# Altium project RC-XD(RX).PrjPcb
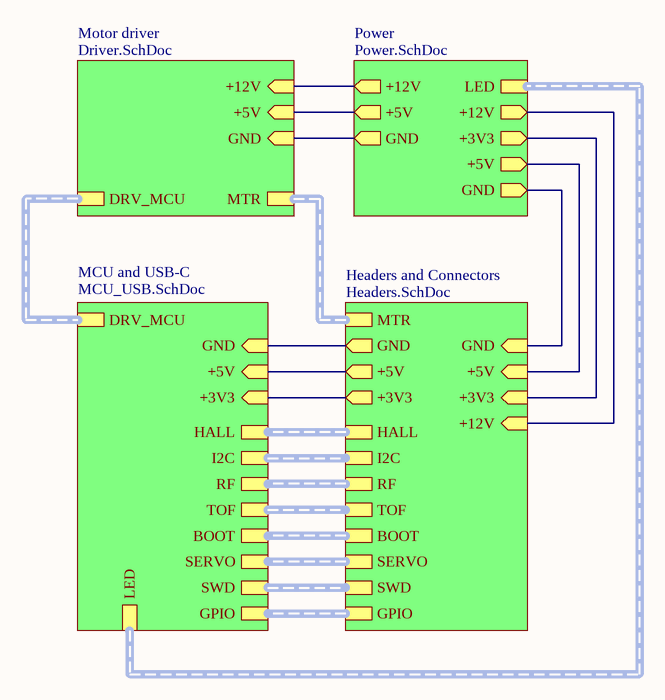
[diagram p0: Overview.SchDoc]
GlobalRevisionEngineer: Robin Madar; GlobalRevisionDate: 2026-03-08; GlobalProjectTitleAbr: RX_PCB; GlobalProjectTitle: RC-XD; GlobalProjectRevision: v1; GlobalAddress2: Harju maakond; GlobalAddress: Tallinn
5 sheets, 85 parts. Net scope: hierarchical (ports join the sheet entries above them; power ports are global).
Board file: RX.PcbDoc
Sheets:
  Overview.SchDoc
    Motor driver = Driver.SchDoc
    Power = Power.SchDoc
    MCU and USB-C = MCU_USB.SchDoc
    Headers and Connectors = Headers.SchDoc

## Sheet Overview.SchDoc
size 297 x 209 mm; SheetNumber: 1; SheetTotal: 5

### Sub-sheets
Headers and Connectors = Headers.SchDoc: +3V3 (in), GND (in), +5V (in), MTR, +3V3 (out), +5V (out), GND (out), HALL, I2C, RF, TOF, BOOT, +12V (in), SERVO, SWD, GPIO
MCU and USB-C = MCU_USB.SchDoc: +3V3 (in), GND (in), +5V (in), DRV_MCU, HALL, I2C, RF, TOF, BOOT, LED, SERVO, SWD, GPIO
Motor driver = Driver.SchDoc: +12V (in), +5V (in), GND (in), MTR, DRV_MCU
Power = Power.SchDoc: +12V (out), +3V3 (out), GND (out), GND (out), +5V (out), +5V (out), LED, +12V (out)

### Nets
(unnamed): sheet Motor driver/+12V, sheet Power/+12V, sheet Power/+12V, sheet Headers and Connectors/+12V
(unnamed): sheet Motor driver/+5V, sheet Power/+5V, sheet Power/+5V, sheet MCU and USB-C/+5V, sheet Headers and Connectors/+5V, sheet Headers and Connectors/+5V
(unnamed): sheet Motor driver/GND, sheet Power/GND, sheet Power/GND, sheet MCU and USB-C/GND, sheet Headers and Connectors/GND, sheet Headers and Connectors/GND
(unnamed): sheet Power/+3V3, sheet MCU and USB-C/+3V3, sheet Headers and Connectors/+3V3, sheet Headers and Connectors/+3V3

### Buses and harness runs
harness sheet Headers and Connectors/BOOT = sheet MCU and USB-C/BOOT
harness sheet Headers and Connectors/GPIO = sheet MCU and USB-C/GPIO
harness sheet Headers and Connectors/HALL = sheet MCU and USB-C/HALL
harness sheet Headers and Connectors/I2C = sheet MCU and USB-C/I2C
harness sheet Headers and Connectors/MTR = sheet Motor driver/MTR
harness sheet Headers and Connectors/RF = sheet MCU and USB-C/RF
harness sheet Headers and Connectors/SERVO = sheet MCU and USB-C/SERVO
harness sheet Headers and Connectors/SWD = sheet MCU and USB-C/SWD
harness sheet Headers and Connectors/TOF = sheet MCU and USB-C/TOF
harness sheet MCU and USB-C/DRV_MCU = sheet Motor driver/DRV_MCU
harness sheet MCU and USB-C/LED = sheet Power/LED

### Notes on the sheet
- THIS DOCUMENT AND THE DATA DISCLOSED HEREIN OR
- HEREWITH IS THE PROPERTY OF ALTIUM LIMITED AND MAY
- DWG NO:
- REVISION
- REV:
- DESCRIPTION
- DATE
- APPROVED
- BE FREELY DISTRIBUTED IN WHOLE. NO RIGHTS ARE
- RESERVED OR EXPRESS OR IMPLIED WARANTEE GIVEN.
- ENG:
- APPROVALS
- PROJECT
- DSN:
- CHK:
- REFERENCE DOCUMENTS
- PROJECT REVISION:
- TITLE
- DOCUMENT REVISION:
- DESIGN ITEM:
- BOM:
- FAB DWG:
- PCB DWG:
- ASSY DWG:
- SCALE:
- A3
- SIZE
- CAGE CODE
- FILE NAME
- DWG NO.
- SHEET
- OF
- REV

## Sheet Driver.SchDoc
size 297 x 209 mm; ENG_APP_DATE: --/--/--; DSN_APP_DATE: --/--/--; CHK_APP_DATE: --/--/--; SheetNumber: 2; SheetTotal: 5
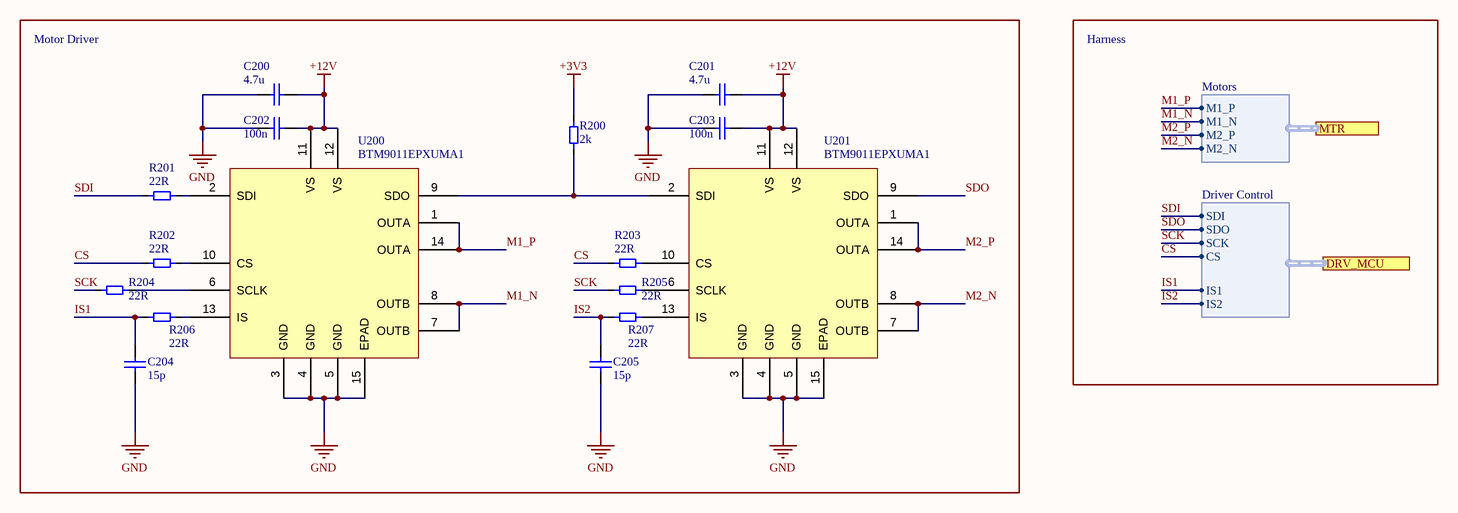
[diagram p1: Driver.SchDoc]

### Parts
C200  4.7u  [MLCC_0603_M]
C201  4.7u  [MLCC_0603_M]
C202  100n  [MLCC_0603_M]
C203  100n  [MLCC_0603_M]
C204  15p  [MLCC_0603_M]
C205  15p  [MLCC_0603_M]
R200  2k  [Resistor_0603_M]
R201  22R  [Resistor_0603_M]
R202  22R  [Resistor_0603_M]
R203  22R  [Resistor_0603_M]
R204  22R  [Resistor_0603_M]
R205  22R  [Resistor_0603_M]
R206  22R  [Resistor_0603_M]
R207  22R  [Resistor_0603_M]
U200  BTM9011EPXUMA1  [BTM9011EPXUMA1]
U201  BTM9011EPXUMA1  [BTM9011EPXUMA1]

### Blocks framed on the sheet
Motor Driver: C200-C205 R200-R207 U200 U201

### Ports
DRV_MCU (harness Driver Control, see Overview[3B], MCU_USB[2A]), MTR (harness Motors, see Overview[3B], Headers[2A])

### Harnesses
Motors: M1_P, M1_N, M2_P, M2_N
Driver Control: SCK, SDO, IS1, SDI, IS2, CS

### Nets
+3V3: R200.2
+12V: C200.2 C201.2 C202.2 C203.2 U200.11(VS) U200.12(VS) U201.11(VS) U201.12(VS)
GND: C200.1 C201.1 C202.1 C203.1 C204.2 C205.2 U200.3(GND) U200.4(GND) U200.5(GND) U200.15(EPAD) U201.3(GND) U201.4(GND) U201.5(GND) U201.15(EPAD)
CS: R202.1 R203.1 ; port DRV_MCU.CS
IS1: C204.1 R206.1 ; port DRV_MCU.IS1
IS2: C205.1 R207.1 ; port DRV_MCU.IS2
M1_N: U200.7(OUTB) U200.8(OUTB) ; port MTR.M1_N
M1_P: U200.1(OUTA) U200.14(OUTA) ; port MTR.M1_P
M2_N: U201.7(OUTB) U201.8(OUTB) ; port MTR.M2_N
M2_P: U201.1(OUTA) U201.14(OUTA) ; port MTR.M2_P
SCK: R204.1 R205.1 ; port DRV_MCU.SCK
SDI: R201.1 ; port DRV_MCU.SDI
SDO: U201.9(SDO) ; port DRV_MCU.SDO
NetR200_1: R200.1 U200.9(SDO) U201.2(SDI)
NetR201_2: R201.2 U200.2(SDI)
NetR202_2: R202.2 U200.10(CS)
NetR203_2: R203.2 U201.10(CS)
NetR204_2: R204.2 U200.6(SCLK)
NetR205_2: R205.2 U201.6(SCLK)
NetR206_2: R206.2 U200.13(IS)
NetR207_2: R207.2 U201.13(IS)

### Notes on the sheet
- Harness
- THIS DOCUMENT AND THE DATA DISCLOSED HEREIN OR
- HEREWITH IS THE PROPERTY OF ALTIUM LIMITED AND MAY
- DWG NO:
- REVISION
- REV:
- DESCRIPTION
- DATE
- APPROVED
- BE FREELY DISTRIBUTED IN WHOLE. NO RIGHTS ARE
- RESERVED OR EXPRESS OR IMPLIED WARANTEE GIVEN.
- ENG:
- APPROVALS
- PROJECT
- DSN:
- CHK:
- REFERENCE DOCUMENTS
- PROJECT REVISION:
- TITLE
- DOCUMENT REVISION:
- DESIGN ITEM:
- BOM:
- FAB DWG:
- PCB DWG:
- ASSY DWG:
- SCALE:
- A3
- SIZE
- CAGE CODE
- FILE NAME
- DWG NO.
- SHEET
- OF
- REV

### Library data of the parts
C200 C201 = CMP-001-1257-1: MLCC, 0603, 4.7u, 10%, 35V, X5R; Manufacturer: Any; Value: 4,7µF; Capacitor Type: Ceramic; Dielectric: X5R; Tolerance: 10%; Voltage: 35V; Part number: MLCC, 0603, 4.7u, 10%, 35V, X5R; Case/Package: 0603; Mount: SMD; RoHS: Yes
C202 C203 = CMP-001-0755-1: MLCC, 0603, 100n, 10%, 35V, X7R; Manufacturer: Any; Capacitor Type: Ceramic; Value: 100nF; Voltage: 35V; Case/Package: 0603; Part number: MLCC, 0603, 100n, 10%, 35V, X7R; RoHS: Yes; Tolerance: 10%; Dielectric: X7R; Mount: SMD
C204 C205 = CMP-001-0474-1: MLCC, 0603, 15p, 5%, 50V, C0G/NP0; Manufacturer: Any; Value: 15pF; Capacitor Type: Ceramic; Dielectric: C0G/NP0; Case/Package: 0603; Part number: MLCC, 0603, 15p, 5%, 50V, C0G/NP0; Voltage: 50V; Mount: SMD; RoHS: Yes; Tolerance: 5%
R200 = CMP-001-0084-2: Resistor, 0603, 2k, 1%, 1/10W; Manufacturer: Any; Power: 100mW; Mount: SMD; Value: 2k; RoHS: Yes; Case/Package: 0603; Part number: Resistor, 0603, 2k, 1%, 1/10W; Tolerance: 1%
R201-R207 = CMP-001-0038-3: Resistor, 0603, 22R, 1%, 1/10W; Manufacturer: Any; Value: 22; Power: 100mW; Part number: Resistor, 0603, 22R, 1%, 1/10W; Tolerance: 1%; Case/Package: 0603; Mount: SMD; RoHS: Yes
U200 U201 = CMP-00022-3: DC Mtr Drive, Brush, 150DEGC, TSSOPEP-14 Rohs Compliant: Yes; Manufacturer: Infineon Technologies; Current - Output: 9.2A; Voltage - Supply: 4.5V ~ 40V; Interface: SPI; Output configuration: Full bridge; Motor Type - AC, DC: Brushed DC; REACH SVHC: Yes; RoHS: Compliant; Voltage - Load: 4.5V ~ 40V; Operating Temperature: -40C ~ 150C; Case/Package: 14-TSSOP; Mount: SMD; Part number: BTM9011EPXUMA1

## Sheet Power.SchDoc
size 297 x 209 mm; SheetNumber: 3; SheetTotal: 5
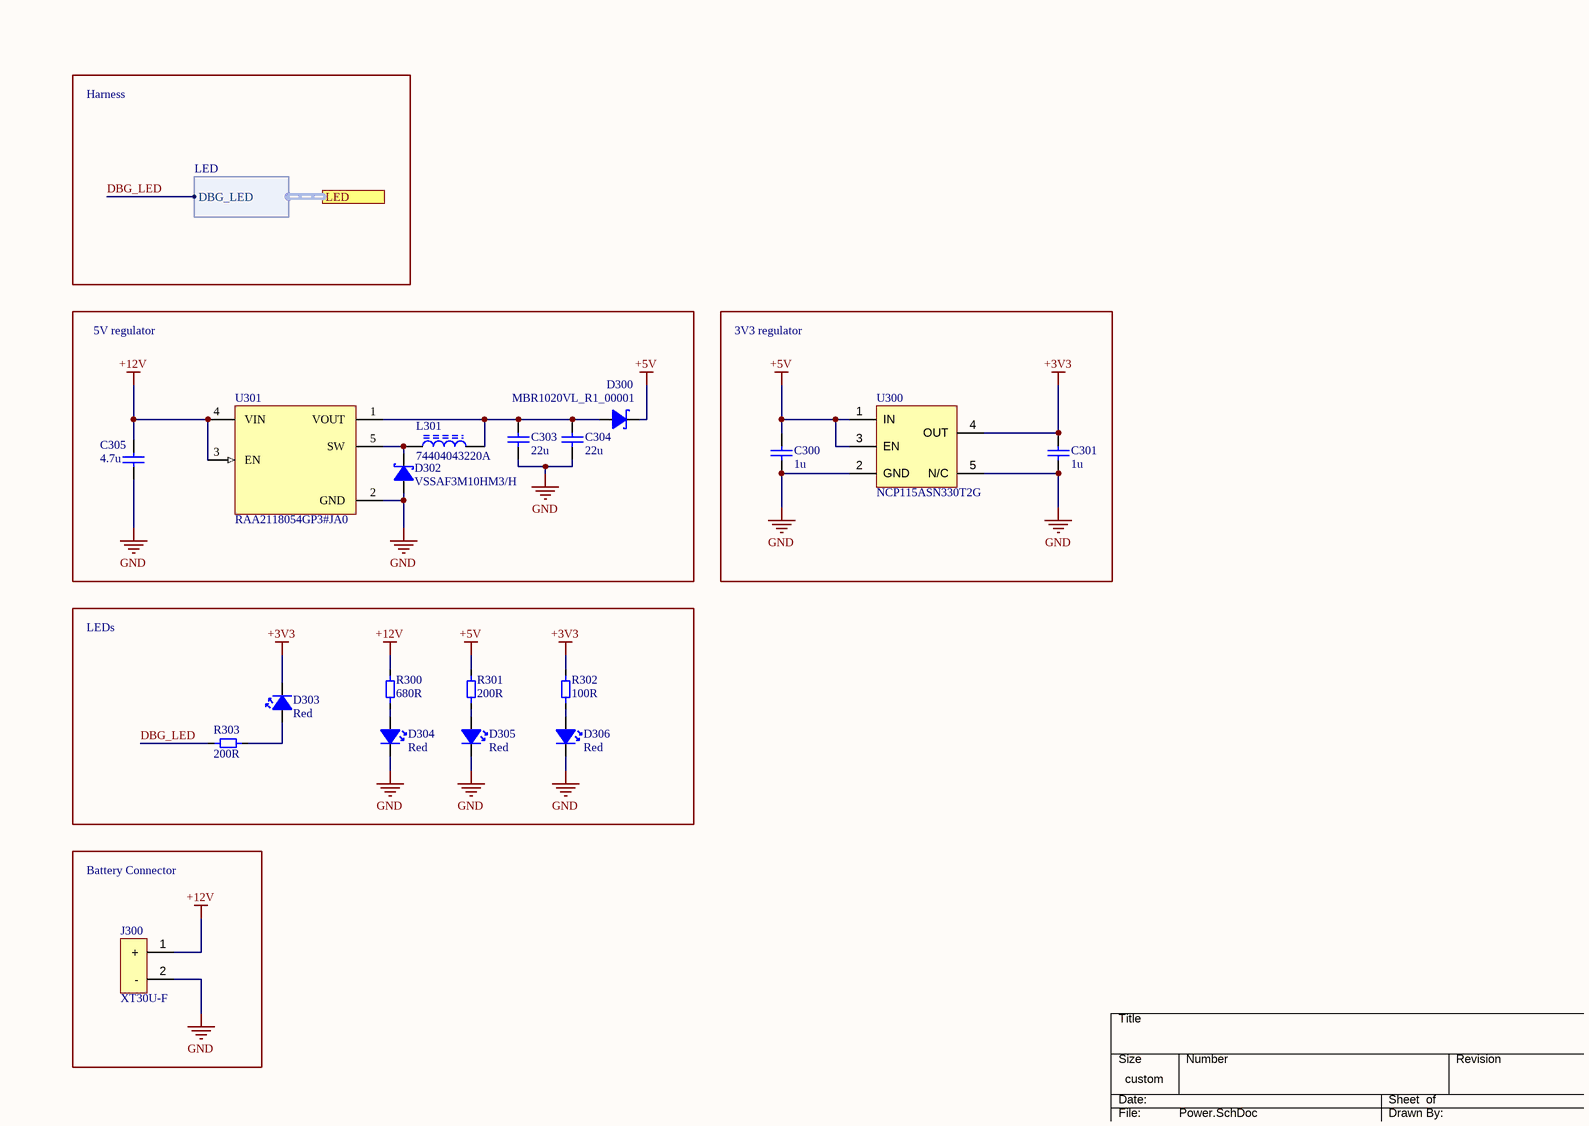
[diagram p2: Power.SchDoc]

### Parts
C300  1u  [MLCC_0603_M]
C301  1u  [MLCC_0603_M]
C303  22u  [MLCC_0603_M]
C304  22u  [MLCC_0603_M]
C305  4.7u  [MLCC_1206_M]
D300  MBR1020VL_R1_00001  [FP-MBR1020VL_R1_00001-MFG]
D302  VSSAF3M10HM3/H  [VSSAF3M10HM3_H-Footprint-1]
D303  Red  [0603 RED LED]
D304  Red  [0603 RED LED]
D305  Red  [0603 RED LED]
D306  Red  [0603 RED LED]
J300  XT30U-F  [XT30U-F]
L301  74404043220A  [WE-LQS_4025]
R300  680R  [Resistor_0603_M]
R301  200R  [Resistor_0603_M]
R302  100R  [Resistor_0603_M]
R303  200R  [Resistor_0603_M]
U300  NCP115ASN330T2G  [TSOP-5]
U301  RAA2118054GP3#JA0  [P5_064B_MFG]

### Blocks framed on the sheet
5V regulator: C303-C305 D300 D302 L301 U301
3V3 regulator: C300 C301 U300
LEDs: D303-D306 R300-R303
Battery Connector: J300

### Ports
LED (harness LED, see Overview[4B], MCU_USB[2B])

### Harnesses
LED: DBG_LED

### Nets
+3V3: C301.2 D303.1(C) R302.2 U300.4(OUT)
+5V: C300.2 D300.1(C) R301.1 U300.1(IN) U300.3(EN)
+12V: C305.2 J300.1(+) R300.2 U301.3(EN) U301.4(VIN)
GND: C300.1 C301.1 C303.1 C304.1 C305.1 D302.2(A) D304.1(C) D305.1(C) D306.1(C) J300.2(-) U300.2(GND) U300.5(N/C) U301.2(GND)
DBG_LED: R303.1 ; port LED.DBG_LED
NetC303_2: C303.2 C304.2 D300.2(A) L301.2 U301.1(VOUT)
NetD302_1: D302.1(C) L301.1 U301.5(SW)
NetD303_2: D303.2(A) R303.2
NetD304_2: D304.2(A) R300.1
NetD305_2: D305.2(A) R301.2
NetD306_2: D306.2(A) R302.1

### Notes on the sheet
- Harness
- THIS DOCUMENT AND THE DATA DISCLOSED HEREIN OR
- HEREWITH IS THE PROPERTY OF ALTIUM LIMITED AND MAY
- DWG NO:
- REVISION
- REV:
- DESCRIPTION
- DATE
- APPROVED
- BE FREELY DISTRIBUTED IN WHOLE. NO RIGHTS ARE
- RESERVED OR EXPRESS OR IMPLIED WARANTEE GIVEN.
- ENG:
- APPROVALS
- PROJECT
- DSN:
- CHK:
- REFERENCE DOCUMENTS
- PROJECT REVISION:
- TITLE
- DOCUMENT REVISION:
- DESIGN ITEM:
- BOM:
- FAB DWG:
- PCB DWG:
- ASSY DWG:
- SCALE:
- A3
- SIZE
- CAGE CODE
- FILE NAME
- DWG NO.
- SHEET
- OF
- REV

### Library data of the parts
C300 C301 = CMP-001-0565-1: MLCC, 0603, 1u, 10%, 50V, X5R; Manufacturer: Any; Capacitor Type: Ceramic; Value: 1µF; Part number: MLCC, 0603, 1u, 10%, 50V, X5R; Dielectric: X5R; Voltage: 50V; RoHS: Yes; Tolerance: 10%; Mount: SMD; Case/Package: 0603
C303 C304 = CMP-001-1264-1: MLCC, 0603, 22u, 10%, 16V, X5R; Manufacturer: Any; Value: 22µF; Capacitor Type: Ceramic; Tolerance: 10%; Case/Package: 0603; Dielectric: X5R; Part number: MLCC, 0603, 22u, 10%, 16V, X5R; Mount: SMD; RoHS: Yes; Voltage: 16V
C305 = CMP-001-1124-2: MLCC, 1206, 4.7u, 10%, 35V, X5R; Manufacturer: Any; Capacitor Type: Ceramic; Value: 4,7µF; RoHS: Yes; Part number: MLCC, 1206, 4.7u, 10%, 35V, X5R; Voltage: 35V; Tolerance: 10%; Case/Package: 1206; Dielectric: X5R; Mount: SMD
D300 = CMP-ROOT-01310-1: Rectifier Diode, Schottky, 1 Phase, 1 Element, 1A, 20V V(RRM), Silicon; Manufacturer: Panjit; Max Forward Surge Current (Ifsm): 45A; Max Junction Temperature (Tj): 125°C; Number of Elements: 1; Peak Reverse Current: 600µA; Case/Package: SOD-123FL; Mount: SMD; Part number: MBR1020VL_R1_00001; Pins: 2; RoHS: Compliant; Forward Current: 1A; Height: 1.1mm; Lifecycle Status: Production; Max Operating Temperature: 125°C; Max Output current: 1A; Max Repetitive Reverse Voltage (Vrrm): 20V; Min Operating Temperature: -55°C; Number of Terminals: 2; REACH SVHC: No; Reverse Standoff Voltage: 20V
D302 = CMP-ROOT-01308-1: Rectifier Diode, Schottky, 1 Phase, 1 Element, 2.3A, 100V V(RRM), Silicon, DO-221AC; Forward Voltage: 720mV; Max Forward Surge Current (Ifsm): 80A; Number of Elements: 1; Peak Reverse Current: 200µA; Case/Package: DO-221AC-2; Manufacturer: VSSAF3M10HM3/H; Mount: SMD; Part number: VSSAF3M10HM3/H; Pins: 2; RoHS: Compliant; Lifecycle Status: Production; Max Operating Temperature: 175°C; Max Output current: 2.3A; Min Operating Temperature: -40°C; Number of Terminals: 2; REACH SVHC: No; Reverse Standoff Voltage: 100V
D303-D306 = CMP-ROOT-00025-2: Generic red 0603 LED; Part number: Any Red 0603 LED; Manufacturer: Any; Color: Red; Case/Package: 0603; Mount: SMD; RoHS: Yes
J300 = CMP-ROOT-01262-3: Power Connector; Manufacturer: AMASS; Case/Package: Non-standard; Mount: SMD; Part number: XT30U-F; Pins: 2; RoHS: Yes; Color: Yellow; Contact Material: Brass; Orientation: Straight
L301 = CMP-ROOT-01309-1: General Purpose Inductor, 22uH, 20%, 1 Element, Nickel-zinc Ferrite-Core, SMD, 1616; Manufacturer: Wurth Elektronik; Value: 22µH; Current Rating: 1.11A; DC Resistance (DCR): 200mΩ; Case/Package: 4mm x 4mm; Mount: SMD; Part number: 74404043220A; Pins: 2; RoHS: Compliant; Ambient Temperature Range High: 85°C; Ambient Temperature Range Low: -40°C; Height: 2.5mm; Inductance Tolerance: 20%; Length: 4mm; Max Operating Temperature: 125°C; Min Operating Temperature: -40°C; Width: 4mm
R300 = CMP-001-0074-3: Resistor, 0603, 680R, 1%, 1/10W; Manufacturer: Any; Power: 100mW; Value: 680; RoHS: Yes; Tolerance: 1%; Mount: SMD; Part number: Resistor, 0603, 680R, 1%, 1/10W; Case/Package: 0603
R301 R303 = CMP-001-0060-2: Resistor, 0603, 200R, 1%, 1/10W; Manufacturer: Any; Value: 200; Power: 100mW; RoHS: Yes; Part number: Resistor, 0603, 200R, 1%, 1/10W; Mount: SMD; Tolerance: 1%; Case/Package: 0603
R302 = CMP-0001-00262-1: Resistor, 0603, 100R, ≤5%, ≥1/16W; Manufacturer: Any; Value: 100; Case/Package: 0603; Mount: SMD; Part number: Resistor, 0603, 100R, ≤5%, ≥1/16W; RoHS: Yes
U300 = CMP-00026-1: LDO Regulator, 300 mA, Low Iq, High PSRR, High Accuracy 3.3V, TSOP5, Active Discharge, Normal Vout Slew-Rate; Manufacturer: onsemi; Accuracy: 1%; Dropout Voltage: 235mV; Max Supply Voltage: 5.5V; Max Junction Temperature (Tj): 85°C; Min Input Voltage: 3.8V; Min Supply Voltage: 1.7V; Nominal Supply Current: 50µA; Number of Channels: 1; Output Current: 300mA; Output Type: Fixed; Voltage Tolerance: 2%; China RoHS: Compliant; Height: 1.1mm; Height - Seated (Max): 1.1mm; Length: 3mm; Lifecycle Status: Production; Manufacturer Lifecycle Status: ACTIVE; Max Operating Temperature: 150°C; Number of Circuits: 1; Number of Outputs: 1; Number of Terminals: 5; Output Voltage: 3.3V; REACH SVHC: Yes; RoHS: Compliant; Schedule B: 8542390000, 8542390000; Terminal Pitch: 950µm; Width: 1.5mm; Case/Package: TSOP-5; Mount: SMD; Part number: NCP115ASN330T2G
U301 = CMP-00019-3: Switching Regulator, Current-mode, 0.3A, 230kHz Switching Freq-Max, PDSO5; Manufacturer Lifecycle Status: ACTIVE; Manufacturer: Renesas / Intersil; Max Supply Voltage: 80V; Max Junction Temperature (Tj): 125°C; Max Output current: 300mA; Max Output Voltage: 5.15V; Min Input Voltage: 7V; Min Output Voltage: 3.18V; Nominal Supply Voltage: 18V; Nominal Output Voltage: 5V; Number of Circuits: 1; Pitch: 1mm; Topology: Buck; Case/Package: TSOT; Export Control Classification Number (ECCN) Code: EAR99; Harmonized Tariff Schedule (HTS) Code: 8540000000; Height: 850µm; Height - Seated (Max): 1.1mm; Length: 2.9mm; Lifecycle Status: Production; MSL: 3; Max Operating Temperature: 125°C; Max Switching Frequency: 230kHz; Min Operating Temperature: -40°C; Mounting Technology: Surface Mount; Pins: 5; Number of Terminals: 5; Package Quantity: 3000; Part Family: RAA211805; REACH SVHC: Yes; RoHS: Compliant; Terminal Pitch: 950µm; Width: 1.6mm; Mount: SMD; Part number: RAA2118054GP3#JA0

## Sheet MCU_USB.SchDoc
size 297 x 209 mm; SheetNumber: 4; SheetTotal: 5
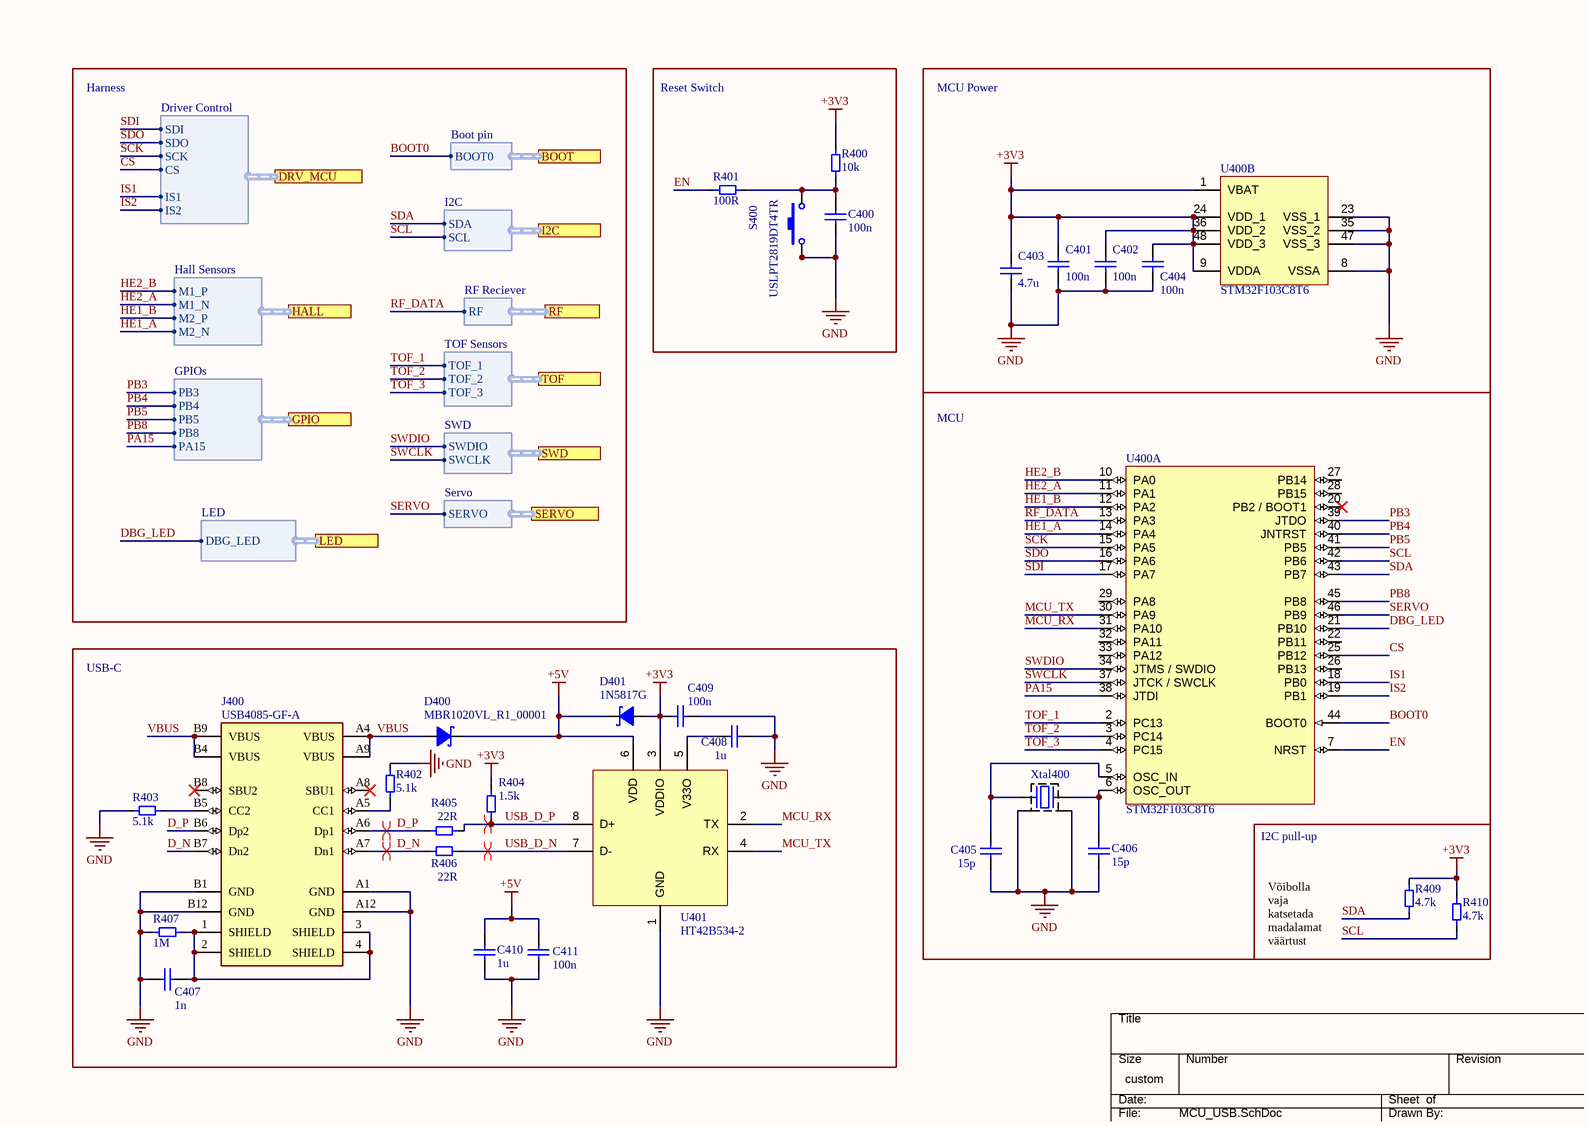
[diagram p3: MCU_USB.SchDoc]

### Parts
C400  100n  [MLCC_0603_M]
C401  100n  [MLCC_0603_M]
C402  100n  [MLCC_0603_M]
C403  4.7u  [MLCC_0805_M]
C404  100n  [MLCC_0603_M]
C405  15p  [MLCC_0402_M]
C406  15p  [MLCC_0402_M]
C407  1n  [MLCC_0603_M]
C408  1u  [MLCC_0603_M]
C409  100n  [MLCC_0603_M]
C410  1u  [MLCC_0603_M]
C411  100n  [MLCC_0603_M]
D400  MBR1020VL_R1_00001  [FP-MBR1020VL_R1_00001-MFG]
D401  1N5817G  [SOD-323 based on 1N5817WS]
J400  USB4085-GF-A  [FP-USB4085-GF-A-MFG]
R400  10k  [Resistor_0603_M]
R401  100R  [Resistor_0603_M]
R402  5.1k  [Resistor_0603_M]
R403  5.1k  [Resistor_0603_M]
R404  1.5k  [Resistor_0603_M]
R405  22R  [Resistor_0603_M]
R406  22R  [Resistor_0603_M]
R407  1M  [Resistor_1206_M]
R409  4.7k  [Resistor_0603_M]
R410  4.7k  [Resistor_0603_M]
S400  USLPT2819DT4TR  [USLPT2819DT4TR-Footprint-1]
U400  STM32F103C8T6  [STM-LQFP48_M]  (parts A,B of 2)
U401  HT42B534-2  [SOP-8 150mil]
Xtal400  ABM11-16.000MHZ-12-N1G-T  [FP-ABM11-MFG]  (value not drawn)

### Blocks framed on the sheet
Reset Switch: C400 R400 R401 S400
MCU Power: C401-C404 U400
MCU: C405 C406 U400 Xtal400
USB-C: C407-C411 D400 D401 J400 R402-R407 U401
I2C pull-up: R409 R410

### Ports
BOOT (harness Boot pin, see Overview[3C], Headers[3A]), DRV_MCU (harness Driver Control, see Overview[3B], Driver[6B]), GPIO (harness GPIOs, see Overview[3C], Headers[5A]), HALL (harness Hall Sensors, see Overview[3C], Headers[2A]), I2C (harness I2C, see Overview[3C], Headers[3A]), LED (harness LED, see Overview[3C], Power[2A]), RF (harness RF Reciever, see Overview[3C], Headers[3A]), SERVO (harness Servo, see Overview[3C], Headers[3A]), SWD (harness SWD, see Overview[3C], Headers[5A]), TOF (harness TOF Sensors, see Overview[3C], Headers[3A])

### Harnesses
Driver Control: SCK, SDO, IS1, SDI, IS2, CS
Hall Sensors: M1_P, M1_N, M2_P, M2_N
LED: DBG_LED
Boot pin: BOOT0
I2C: SDA, SCL
TOF Sensors: TOF_1, TOF_2, TOF_3
RF Reciever: RF
SWD: SWDIO, SWCLK
Servo: SERVO
GPIOs: PB4, PB5, PB8, PA15, PB3

### Nets
+3V3: C401.1 C402.1 C403.2 C404.1 C409.1 D401.2(A) R400.2 R404.2 R409.2 R410.2 U400.1(VBAT) U400.9(VDDA) U400.24(VDD_1) U400.36(VDD_2) U400.48(VDD_3) U401.3(VDDIO)
+5V: C410.2 C411.1 D400.1(C) D401.1(C) U401.6(VDD)
GND: C400.1 C401.2 C402.2 C403.1 C404.2 C405.1 C406.1 C407.1 C408.2 C409.2 C410.1 C411.2 J400.A1(GND) J400.A12(GND) J400.B1(GND) J400.B12(GND) R402.2 R403.1 R407.2 S400.1 S400.2 U400.8(VSSA) U400.23(VSS_1) U400.35(VSS_2) U400.47(VSS_3) U401.1(GND) Xtal400.2 Xtal400.4
BOOT0: U400.44(BOOT0) ; port BOOT.BOOT0
CS: U400.25(PB12) ; port DRV_MCU.CS
D_N: J400.A7(Dn1) J400.B7(Dn2) R406.1
D_P: J400.A6(Dp1) J400.B6(Dp2) R405.1
DBG_LED: U400.21(PB10) ; port LED.DBG_LED
EN: R401.2 U400.7(NRST)
HE1_A: U400.14(PA4) ; port HALL.M2_N
HE1_B: U400.12(PA2) ; port HALL.M2_P
HE2_A: U400.11(PA1) ; port HALL.M1_N
HE2_B: U400.10(PA0) ; port HALL.M1_P
IS1: U400.18(PB0) ; port DRV_MCU.IS1
IS2: U400.19(PB1) ; port DRV_MCU.IS2
MCU_RX: U400.31(PA10) U401.2(TX)
MCU_TX: U400.30(PA9) U401.4(RX)
PA15: U400.38(JTDI) ; port GPIO.PA15
PB3: U400.39(JTDO) ; port GPIO.PB3
PB4: U400.40(JNTRST) ; port GPIO.PB4
PB5: U400.41(PB5) ; port GPIO.PB5
PB8: U400.45(PB8) ; port GPIO.PB8
RF_DATA: U400.13(PA3) ; port RF.RF
SCK: U400.15(PA5) ; port DRV_MCU.SCK
SCL: R410.1 U400.42(PB6) ; port I2C.SCL
SDA: R409.1 U400.43(PB7) ; port I2C.SDA
SDI: U400.17(PA7) ; port DRV_MCU.SDI
SDO: U400.16(PA6) ; port DRV_MCU.SDO
SERVO: U400.46(PB9) ; port SERVO.SERVO
SWCLK: U400.37(JTCK_/_SWCLK) ; port SWD.SWCLK
SWDIO: U400.34(JTMS_/_SWDIO) ; port SWD.SWDIO
TOF_1: U400.2(PC13) ; port TOF.TOF_1
TOF_2: U400.3(PC14) ; port TOF.TOF_2
TOF_3: U400.4(PC15) ; port TOF.TOF_3
USB_D_N: R406.2 U401.7(D-)
USB_D_P: R404.1 R405.2 U401.8(D+)
VBUS: D400.2(A) J400.A4(VBUS) J400.A9(VBUS) J400.B4(VBUS) J400.B9(VBUS)
NetC400_2: C400.2 R400.1 R401.1 S400.3 S400.4
NetC405_2: C405.2 U400.5(OSC_IN) Xtal400.1
NetC406_2: C406.2 U400.6(OSC_OUT) Xtal400.3
NetC407_2: C407.2 J400.1(SHIELD) J400.2(SHIELD) J400.3(SHIELD) J400.4(SHIELD) R407.1
NetC408_1: C408.1 U401.5(V33O)
NetJ400_A5: J400.A5(CC1) R402.1
NetJ400_B5: J400.B5(CC2) R403.2

Not connected (* = marked no-connect by the designer): J400 A8(SBU1)* B8(SBU2)*; U400 20(PB2_/_BOOT1)* 22(PB11) 26(PB13) 27(PB14) 28(PB15) 29(PA8) 32(PA11) 33(PA12)

### Layout directives
differential pair: D_N, D_P, USB_D_N, USB_D_P

### Notes on the sheet
- Harness
- Võibolla vaja katsetada madalamat väärtust
- THIS DOCUMENT AND THE DATA DISCLOSED HEREIN OR
- HEREWITH IS THE PROPERTY OF ALTIUM LIMITED AND MAY
- DWG NO:
- REVISION
- REV:
- DESCRIPTION
- DATE
- APPROVED
- BE FREELY DISTRIBUTED IN WHOLE. NO RIGHTS ARE
- RESERVED OR EXPRESS OR IMPLIED WARANTEE GIVEN.
- ENG:
- APPROVALS
- PROJECT
- DSN:
- CHK:
- REFERENCE DOCUMENTS
- PROJECT REVISION:
- TITLE
- DOCUMENT REVISION:
- DESIGN ITEM:
- BOM:
- FAB DWG:
- PCB DWG:
- ASSY DWG:
- SCALE:
- A3
- SIZE
- CAGE CODE
- FILE NAME
- DWG NO.
- SHEET
- OF
- REV

### Library data of the parts
C400-C402 C404 C409 C411 = CMP-001-0815-1: MLCC, 0603, 100n, 10%, 50V, X7R; Manufacturer: Any; Value: 100nF; Capacitor Type: Ceramic; Part number: MLCC, 0603, 100n, 10%, 50V, X7R; RoHS: Yes; Dielectric: X7R; Mount: SMD; Voltage: 50V; Tolerance: 10%; Case/Package: 0603
C403 = CMP-001-1830-1: MLCC, 0805, 4.7u, 20%, 50V, X5R; Manufacturer: Any; Capacitor Type: Ceramic; Value: 4.7µF; Mount: SMD; Case/Package: 0805; Dielectric: X5R; RoHS: Yes; Part number: MLCC, 0805, 4.7u, 20%, 50V, X5R; Voltage: 50V; Tolerance: 20%
C405 C406 = CMP-001-1853-1: MLCC, 0402, 15p, 10%, 25V, C0G/NP0; Manufacturer: Any; Capacitor Type: Ceramic; Voltage Rating: 25; Value: 15pF; Dielectric: C0G; Temperature Coefficient: 300ppm/°C; Height: 0.5mm; Width: 0.02inch; Contact Plating: Tin; Package Quantity: 1; Case/Package: 0402; Depth: 0.5mm; Material: Ceramic; Packaging: Tape and Reel; Radiation Hardening: No; Case Code (Imperial): 0402; Min Operating Temperature: -55°C; Mount: Surface Mount; RoHS: Yes; Length: 1mm; Thickness: 0.022inch; Part number: MLCC, 0402, 15p, 10%, 25V, C0G/NP0; Capacitance: 15pF; Tolerance: 10%; Case Code (Metric): 1005; Voltage: 25V; Max Operating Temperature: 125°C
C407 = CMP-001-0547-1: MLCC, 0603, 1n, 10%, 50V, X5R; Manufacturer: Any; Capacitor Type: Ceramic; Value: 1nF; Case/Package: 0603; Part number: MLCC, 0603, 1n, 10%, 50V, X5R; RoHS: Yes; Dielectric: X5R; Mount: SMD; Tolerance: 10%; Voltage: 50V
C408 C410 = CMP-001-0565-1: as C300 on sheet Power; Part number: MLCC, 0603, 1u, 10%, 50V, X5R; Dielectric: X5R; Voltage: 50V; RoHS: Yes; Tolerance: 10%; Mount: SMD; Case/Package: 0603
D400 = CMP-ROOT-01310-1: as D300 on sheet Power; Case/Package: SOD-123FL; Mount: SMD; Part number: MBR1020VL_R1_00001; Pins: 2; RoHS: Compliant; Forward Current: 1A; Height: 1.1mm; Lifecycle Status: Production; Max Operating Temperature: 125°C; Max Output current: 1A; Max Repetitive Reverse Voltage (Vrrm): 20V; Min Operating Temperature: -55°C; Number of Terminals: 2; REACH SVHC: No; Reverse Standoff Voltage: 20V
D401 = CMP-ROOT-01323-1: Rectifier Diode, Schottky, 1 Phase, 1 Element, 1A, 20V V(RRM), Silicon, DO-204AL; Manufacturer: TWGMC / onsemi; Part number: 1N5817WS; Manufacturer Lifecycle Status: ACTIVE; Element Configuration: Single; Forward Voltage: 320mV; Max Forward Surge Current (Ifsm): 25A; Number of Elements: 1; Peak Reverse Current: 1mA; Polarity: Standard; Case/Package: Axial; Mount: SMD; Pins: 2; RoHS: Compliant; Average Rectified Current: 1A; Breakdown Voltage: 20V; China RoHS: Non-Compliant; Country of Origin: Mainland China; Current Rating: 1A; Diameter: 2.7mm; Export Control Classification Number (ECCN) Code: EAR99; Forward Current: 1A; Halogen Free: Halogen Free; Harmonized Tariff Schedule (HTS) Code: 8541.10.00.80; Height: 2.7mm; Introduction Date: 1997-05-06; Lead Free: Lead Free; Length: 5.1816mm; Lifecycle Status: Production; Max Operating Temperature: 125°C; Max Output current: 1A; Max Repetitive Reverse Voltage (Vrrm): 20V; Max Reverse Voltage (DC): 20V; Min Operating Temperature: -65°C; Number of Terminals: 2; Output Current: 1A; Packaging: Bulk; Peak Non-Repetitive Surge Current: 25A; REACH SVHC: No; Radiation Hardening: No; Reverse Standoff Voltage: 20V; Schedule B: 8541100080, 8541100080; Voltage Rating (DC): 20V; Weight: 4.535924g; Width: 2.7mm
J400 = CMP-001-1800-1: USB Connector, 16 Contact(s), Female, Right Angle, Solder Terminal, Locking, Receptacle; Manufacturer: GCT; Part number: USB4800-03-A; USB Standard: USB 2.0; Standoff Height: 3.5mm; USB PD: 3.2; Current Rating: 4.25A; Mating Cycles: 10000; Number of Contacts: 16; Number of Ports: 1; Shielding: Shielded; Voltage Rating: 20V; RoHS: Yes; Pins: 16; Mount: TH; Connector Type: USB; Contact Material: Copper Alloy; Contact Plating: Gold; Flammability Rating: UL94 V-0; Gender: Receptacle; Height: 3.66mm; Insulation Color: Black; Max Operating Temperature: 85°C; Min Operating Temperature: -40°C; Mounting Technology: Through Hole,Horizontal; Number of Positions: 16; Orientation: Right Angle; Packaging: Tape and Reel; Series: USB4085; Termination: Solder
R400 = CMP-001-0101-2: Resistor, 0603, 10k, 1%, 1/10W; Manufacturer: Any; Power: 100mW; Tolerance: 1%; Value: 10k; RoHS: Yes; Mount: SMD; Case/Package: 0603; Part number: Resistor, 0603, 10k, 1%, 1/10W
R401 = CMP-001-0054-5: Resistor, 0603, 100R, 1%, 1/10W; Manufacturer: Any; Value: 100; Power: 100mW; Case/Package: 0603; Mount: SMD; Part number: Resistor, 0603, 100R, 1%, 1/10W; Tolerance: 1%; RoHS: Yes
R402 R403 = CMP-001-0094-2: Resistor, 0603, 5.1k, 1%, 1/10W; Manufacturer: Any; Power: 100mW; Value: 5,1k; Case/Package: 0603; Part number: Resistor, 0603, 5.1k, 1%, 1/10W; Mount: SMD; Tolerance: 1%; RoHS: Yes
R404 = CMP-001-0081-2: Resistor, 0603, 1.5k, 1%, 1/10W; Manufacturer: Any; Power: 100mW; Value: 1,5k; Case/Package: 0603; Mount: SMD; RoHS: Yes; Part number: Resistor, 0603, 1.5k, 1%, 1/10W; Tolerance: 1%
R405 R406 = CMP-001-0038-3: as R201 on sheet Driver; Part number: Resistor, 0603, 22R, 1%, 1/10W; Tolerance: 1%; Case/Package: 0603; Mount: SMD; RoHS: Yes
R407 = CMP-0001-00051-1: Resistor, 1206, 1M, 1%, 1/4W; Manufacturer: Any; Case/Package: 1206; RoHS: Yes; Value: 1M; Mount: SMD; Part number: Any
R409 R410 = CMP-001-0093-2: Resistor, 0603, 4.7k, 1%, 1/10W; Manufacturer: Any; Power: 100mW; Value: 4,7k; Part number: Resistor, 0603, 4.7k, 1%, 1/10W; Case/Package: 0603; RoHS: Yes; Tolerance: 1%; Mount: SMD
S400 = CMP-ROOT-01290-1: Keypad Switch, SPST, 0.05A, 1.96N, Solder Terminal, Panel Mount; Manufacturer: TE Connectivity ALCOSWITCH Switches; Contact Current Rating: 50mA; Case/Package: Non-standard; Mount: SMD; Part number: USLPT2819DT4TR; RoHS: Compliant; China RoHS: Compliant; Color: Black; Contact Material: Stainless Steel; Contact Plating: Silver; Housing Material: Polyethylene; Lifecycle Status: Production; Max Current Rating: 50mA; Max Operating Temperature: 85°C; Min Operating Temperature: -40°C; Operating Force: 1.96N; Packaging: Tape & Reel; REACH SVHC: Yes; Throw Configuration: SPST
U400 = CMP-00012-3: MCU 32-bit STM32F1 ARM Cortex M3 RISC 64KB Flash 2.5V/3.3V 48-Pin LQFP Tray; Manufacturer: STMicroelectronics; Manufacturer Package Identifier: ai14911d; Address Bus Width: 32b; Frequency: 72MHz; Interface: CAN, USB; Clock Frequency: 16MHz; Max Power Dissipation: 363mW; Max Supply Current: 50mA; Max Supply Voltage: 3.6V; Min Supply Voltage: 2V; Nominal Supply Current: 1.7µA; Number of A/D Converters: 2; Number of ADC Channels: 10; Number of I/Os: 37; Number of Programmable I/O: 48; Number of Timers/Counters: 4; Number of USART Channels: 3; Operating Supply Voltage: 3.3V; Oscillator Type: Internal; Peripherals: POR; RAM Size: 20kB; Watchdog Timer: Yes; ADC Channels (Resolution): 10-Ch 12-Bit; Density: 512kb; EEPROM Memory Size: 0B; Number of Bits: 32; Number of Interrupts: 16; Number of PWM Channels: 1; Case/Package: LQFP; China RoHS: Compliant; Core Architecture: ARM; Data Bus Width: 32b; Flash Memory Size: 64kB; Height: 1.45mm; Lead Free: Lead Free; Length: 7mm; Lifecycle Status: Production; Max Operating Temperature: 85°C; Memory Size: 64kB; Memory Format: FLASH; Min Operating Temperature: -40°C; Number of Channels: 10; Number of I2C Channels: 2; Pins: 48; Number of SPI Channels: 2; Number of Terminals: 48; REACH SVHC: Yes; Radiation Hardening: No; RoHS: Compliant; Schedule B: 8542310000; Terminal Pitch: 500µm; Width: 7mm; Mount: SMD; Part number: STM32F103C8T6; Height - Seated (Max): 1.6mm; Mounting Technology: Surface Mount; Termination: SMD/SMT
U401 = CMP-00027-2: USB to UART 3Mbps USB 2.0 SOP-8 Interface Controllers RoHS; Manufacturer: HOLTEK; Harmonized Tariff Schedule (HTS) Code: 8542.31.00.30; Introduction Date: 2019-03-26; Lifecycle Status: NRND; Case/Package: SOP-8; Mount: SMD; Part number: HT42B534-2; Pins: 8; RoHS: Yes
Xtal400 = CMP-ROOT-01254-3: Crystal 16MHz ±10ppm (Tol) ±15ppm (Stability) 12pF FUND 150Ohm 4-Pin Ultra Mini-CSMD T/R; Manufacturer: Abracon LLC; ESR (Equivalent Series Resistance): 150Ω; Frequency Tolerance: 0.001%; Case/Package: 4-SMD, No Lead; Mount: SMD; RoHS: Compliant; China RoHS: Compliant; Frequency: 16MHz; Frequency Stability: 15ppm; Height: 590µm; Length: 2mm; Lifecycle Status: Production; Load Capacitance: 12pF; Max Operating Temperature: 85°C; Min Operating Temperature: -30°C; Mounting Technology: Surface Mount; REACH SVHC: Yes; Schedule B: 8541600080; ESR: 150Ω; Tolerance: 0.001%; Width: 1.6mm

## Sheet Headers.SchDoc: Name project title here
size 297 x 209 mm; Organization: Krakul OÜ; Address1: Kaare tee 3, lubja; Address2: viimsi vald; Address3: harju maakond; Address4: Estonia 74010; DocumentNumber: No here; Revision: 0; SheetNumber: 5; SheetTotal: 5
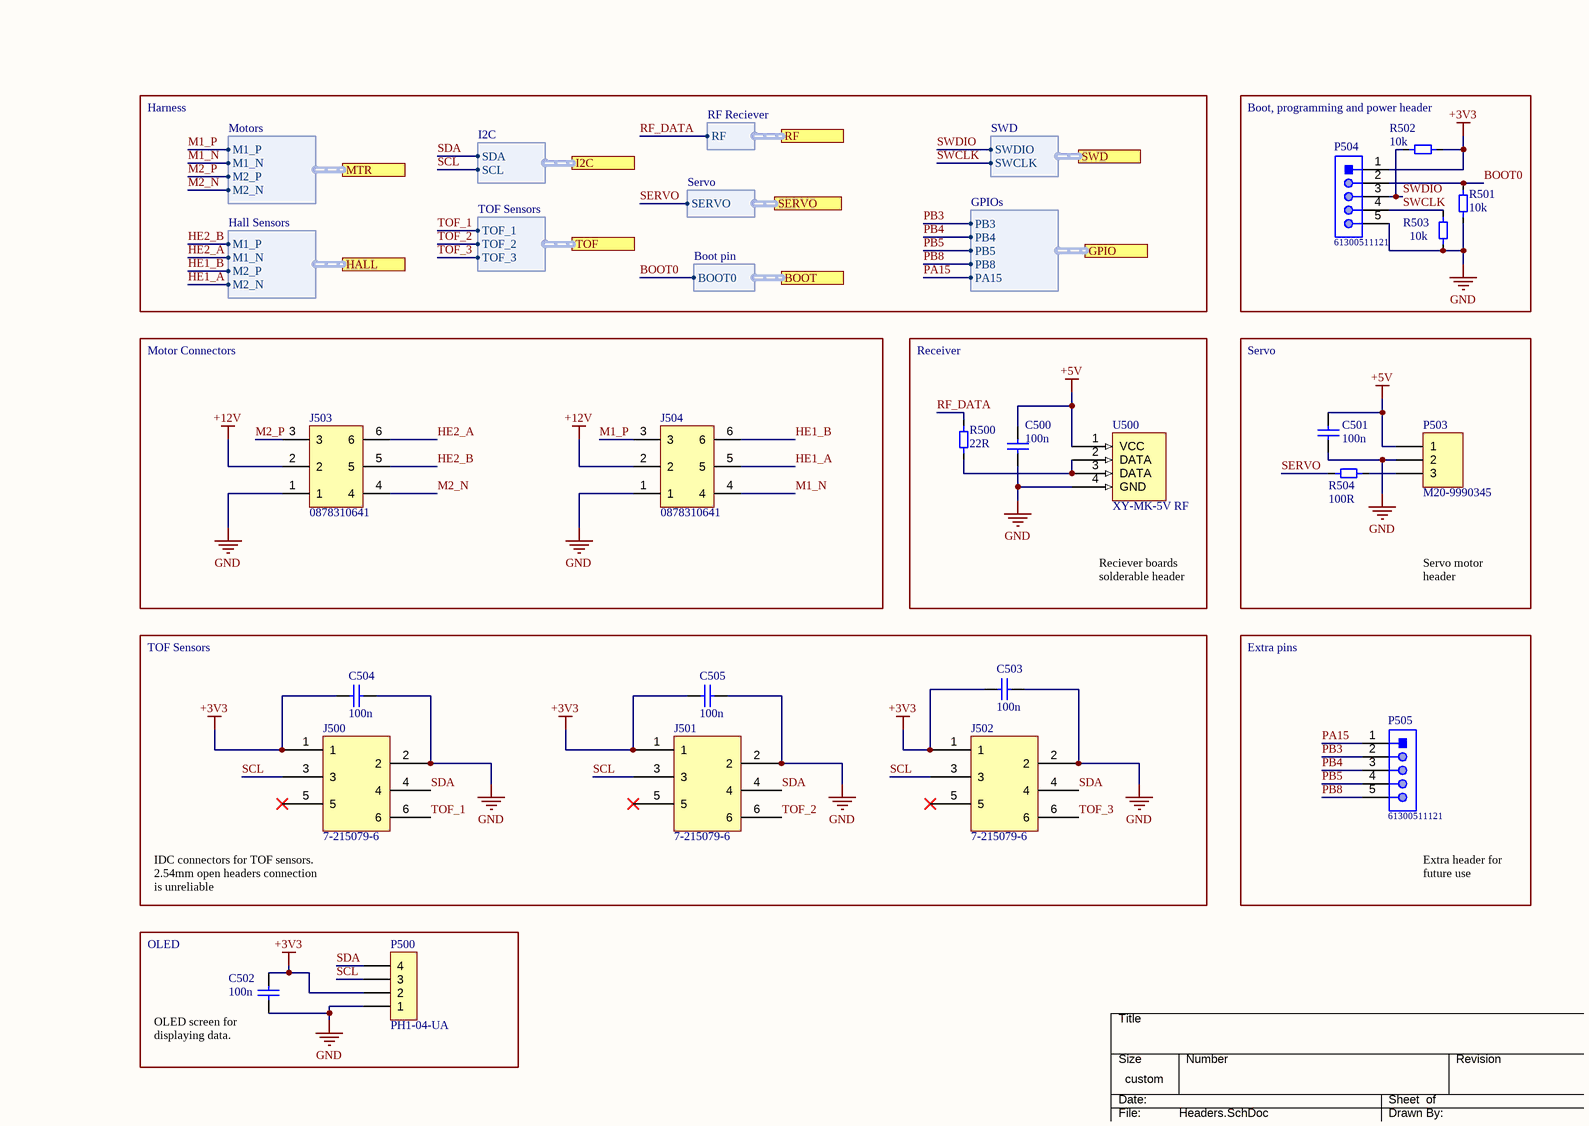
[diagram p4: Headers.SchDoc]

### Parts
C500  100n  [MLCC_0603_M]
C501  100n  [MLCC_0603_M]
C502  100n  [MLCC_0603_M]
C503  100n  [MLCC_0603_M]
C504  100n  [MLCC_0603_M]
C505  100n  [MLCC_0603_M]
J500  7-215079-6  [7-215079-6-Footprint-1]
J501  7-215079-6  [7-215079-6-Footprint-1]
J502  7-215079-6  [7-215079-6-Footprint-1]
J503  0878310641  [0878310641]
J504  0878310641  [0878310641]
P500  PH1-04-UA  [4Pos Pin Header Vertical]
P503  M20-9990345  [3Pos Pin Header]
P504  61300511121  [61300511121]
P505  61300511121  [61300511121]
R500  22R  [Resistor_0603_M]
R501  10k  [Resistor_0603_M]
R502  10k  [Resistor_0603_M]
R503  10k  [Resistor_0603_M]
R504  100R  [Resistor_0603_M]
U500  XY-MK-5V RF  [2.54mm 4 POS XY-MK-5V RF]

### Blocks framed on the sheet
Boot, programming and power header: P504 R501-R503
Motor Connectors: J503 J504
Receiver: C500 R500 U500
Servo: C501 P503 R504
TOF Sensors: C503-C505 J500-J502
Extra pins: P505
OLED: C502 P500

### Ports
BOOT (harness Boot pin, see Overview[3C], MCU_USB[3A]), GPIO (harness GPIOs, see Overview[3C], MCU_USB[2B]), HALL (harness Hall Sensors, see Overview[3C], MCU_USB[2B]), I2C (harness I2C, see Overview[3C], MCU_USB[3A]), MTR (harness Motors, see Overview[3B], Driver[6A]), RF (harness RF Reciever, see Overview[3C], MCU_USB[3B]), SERVO (harness Servo, see Overview[3C], MCU_USB[3B]), SWD (harness SWD, see Overview[3C], MCU_USB[3B]), TOF (harness TOF Sensors, see Overview[3C], MCU_USB[3B])

### Harnesses
Motors: M1_P, M1_N, M2_P, M2_N
Hall Sensors: M1_P, M1_N, M2_P, M2_N
I2C: SDA, SCL
TOF Sensors: TOF_1, TOF_2, TOF_3
RF Reciever: RF
Boot pin: BOOT0
SWD: SWDIO, SWCLK
Servo: SERVO
GPIOs: PB4, PB5, PB8, PA15, PB3

### Nets
+3V3: C502.1 C503.1 C504.1 C505.1 J500.1 J501.1 J502.1 P500.2 P504.1 R502.1
+5V: C500.1 C501.1 P503.1 U500.1(VCC)
+12V: J503.2 J504.2
GND: C500.2 C501.2 C502.2 C503.2 C504.2 C505.2 J500.2 J501.2 J502.2 J503.1 J504.1 P500.1 P503.2 P504.5 R501.1 R503.1 U500.4(GND)
BOOT0: P504.2 R501.2 ; port BOOT.BOOT0
HE1_A: J504.5 ; port HALL.M2_N
HE1_B: J504.6 ; port HALL.M2_P
HE2_A: J503.6 ; port HALL.M1_N
HE2_B: J503.5 ; port HALL.M1_P
M1_N: J504.4 ; port MTR.M1_N
M1_P: J504.3 ; port MTR.M1_P
M2_N: J503.4 ; port MTR.M2_N
M2_P: J503.3 ; port MTR.M2_P
PA15: P505.1 ; port GPIO.PA15
PB3: P505.2 ; port GPIO.PB3
PB4: P505.3 ; port GPIO.PB4
PB5: P505.4 ; port GPIO.PB5
PB8: P505.5 ; port GPIO.PB8
RF_DATA: R500.1 ; port RF.RF
SCL: J500.3 J501.3 J502.3 P500.3 ; port I2C.SCL
SDA: J500.4 J501.4 J502.4 P500.4 ; port I2C.SDA
SERVO: R504.2 ; port SERVO.SERVO
SWCLK: P504.4 R503.2 ; port SWD.SWCLK
SWDIO: P504.3 R502.2 ; port SWD.SWDIO
TOF_1: J500.6 ; port TOF.TOF_1
TOF_2: J501.6 ; port TOF.TOF_2
TOF_3: J502.6 ; port TOF.TOF_3
NetP503_3: P503.3 R504.1
NetR500_2: R500.2 U500.2(DATA) U500.3(DATA)

Not connected (* = marked no-connect by the designer): J500 5*; J501 5*; J502 5*

### Notes on the sheet
- Harness
- Reciever boards solderable header
- Servo motor header
- (near J500) IDC connectors for TOF sensors. 2.54mm open headers connection is unreliable
- Extra header for future use
- (near C502) OLED screen for displaying data.
- Title:
- Date:
- Last modified:
- Project:
- Sheet
- Time:
- of
- Size:
- A3
- Engineer:
- Revision:
- Revision date:
- Checked by:

### Library data of the parts
C500-C505 = CMP-001-0815-1: as C400 on sheet MCU_USB; Part number: MLCC, 0603, 100n, 10%, 50V, X7R; RoHS: Yes; Dielectric: X7R; Mount: SMD; Voltage: 50V; Tolerance: 10%; Case/Package: 0603
J500-J502 = CMP-ROOT-01311-2: Conn FFC Connector F 6 POS 1.27mm Solder ST Thru-Hole Automotive Box/Carton; Manufacturer: TE Connectivity; Manufacturer Lifecycle Status: ACTIVE; Contact Current Rating: 1A; Contact Resistance: 10mΩ; Insulation Resistance: 1GΩ; Mating Connector Lock: Without; Number of Contacts: 6; Number of Ports: 1; Operating Force: 4.8928N; Operating Supply Voltage: 100V; PCB Mount Retention: With; Plating Thickness: 4.99999µm; Row Spacing: 2.54mm; Shielding: No; Mount: TH; Part number: 7-215079-6; Pins: 6; RoHS: Compliant; China RoHS: Compliant; Color: Red; Contact Gender: Female; Contact Material: Nickel, Tin; Contact Plating: Tin; Current Rating: 1A; Height: 4.2mm; Housing Color: Red; Insulation Material: Thermoplastic; Lead Free: Lead Free; Lead Pitch: 1.27mm; Length: 9.7mm; Lifecycle Status: Production; Max Operating Temperature: 105°C; Min Operating Temperature: -40°C; Mounting Technology: Through Hole; Number of Positions: 6; Number of Rows: 2; Orientation: Vertical; Packaging: Box; REACH SVHC: Yes; Terminal Pitch: 1.27mm; Voltage Rating: 100V; Voltage Rating (DC): 100V
J503 J504 = CMP-ROOT-01318-3: Conn Shrouded Header (2 Sides) HDR 6 POS 2mm Solder ST Top Entry Thru-Hole Milli-Grid Tube; Manufacturer: Molex; Manufacturer Lifecycle Status: ACTIVE; Current Rating: 2A; Dielectric Material: Polyamide; Insulation Resistance: 1GΩ; Number of Circuits: 6; Operating Force: 1.9N; Plating: Tin; Plating Thickness: 762nm; Mount: TH; Part number: 0878310641; Pins: 6; RoHS: Compliant; China RoHS: Compliant; Contact Gender: Male; Contact Plating: Gold; Export Control Classification Number (ECCN) Code: EAR99; Harmonized Tariff Schedule (HTS) Code: 8536.69.40.40; Introduction Date: 2014-01-28; Lifecycle Status: Production; Max Operating Temperature: 105°C; Min Operating Temperature: -55°C; Number of Rows: 2; Orientation: Vertical; REACH SVHC: Yes; Row Spacing: 2mm; Schedule B: 8536694040, 8536694040; Terminal Pitch: 2mm
P500 = CMP-002-000004-1: 4 POS 2.54mm Vertical THT Header; Manufacturer: Adam Tech; Number of Positions: 4; Pins: 4; RoHS: Yes; Part number: PH1-04-UA; Mount: TH; Lead Free: Lead Free; Pitch: 2.54mm; Termination: Through Hole
P503 = CMP-ROOT-00217-1: Connector Header Through Hole 3 position 0.100" (2.54mm); Manufacturer: Harwin Inc.; Insulation Resistance: 10GR; Number of Positions: 3; Voltage Rating (AC): 750V; Max Current Rating: 3A; Contact Resistance: 25mR; Connector Type: Male Pin; Min Operating Temperature: -40°C; Contact Material: Brass,Bronze; Package Quantity: 1000; Housing Material: Nylon; Contact Plating: Gold; Contact Mating Length: 0.24inch; Pitch: 2.54mm; Number of Rows: 1; REACH SVHC: No SVHC; Packaging: Bulk; Housing Color: Black; Width: 0.25inch; Number of Contacts: 3; Pins: 3; Mount: Through Hole; Radiation Hardening: No; RoHS: Yes; Weight: 0.006138oz; Depth: 2.54mm; Color: Black; Part number: M20-9990345; Case/Package: SIL; Termination: Solder; Max Operating Temperature: 105°C; Current Rating: 3A; Length: 7.62mm; Height: 0.125inch; Orientation: Straight
P504 P505 = CMP-ROOT-01020-1: Conn Unshrouded Header HDR 5 POS 2.54mm Solder ST Top Entry Thru-Hole Bag; Manufacturer: Wurth; Mount: TH; Part number: 61300511121; RoHS: Yes
R500 = CMP-001-0038-3: as R201 on sheet Driver; Part number: Resistor, 0603, 22R, 1%, 1/10W; Tolerance: 1%; Case/Package: 0603; Mount: SMD; RoHS: Yes
R501 = CMP-0001-00257-1: Resistor, 0603, 10k, ≤5%, ≥1/16W; Manufacturer: Any; Case/Package: 0603; Mount: SMD; Part number: Resistor, 0603, 10k, ≤5%, ≥1/16W; RoHS: Yes; Value: 10k
R502 R503 = CMP-001-0101-2: as R400 on sheet MCU_USB; Tolerance: 1%; Value: 10k; RoHS: Yes; Mount: SMD; Case/Package: 0603; Part number: Resistor, 0603, 10k, 1%, 1/10W
R504 = CMP-001-0054-5: as R401 on sheet MCU_USB; Case/Package: 0603; Mount: SMD; Part number: Resistor, 0603, 100R, 1%, 1/10W; Tolerance: 1%; RoHS: Yes
U500 = CMP-00015-1: 433MHz reciever module, 5V tolerant; Manufacturer: Unknown; Case/Package: 2.54mm 4 POS; Mount: THT; Part number: XY-MK-5V RF; RoHS: Yes

## Nets that join several sheets
+3V3: Driver (R200.2), Power (C301.2 D303.1 R302.2 U300.4), MCU_USB (16 pins), Headers (10 pins)
+5V: Power (5 pins), MCU_USB (5 pins), Headers (C500.1 C501.1 P503.1 U500.1)
+12V: Driver (8 pins), Power (5 pins), Headers (J503.2 J504.2)
GND: Driver (14 pins), Power (13 pins), MCU_USB (28 pins), Headers (17 pins)
BOOT0: MCU_USB (U400.44), Headers (P504.2 R501.2)
CS: Driver (R202.1 R203.1), MCU_USB (U400.25)
DBG_LED: Power (R303.1), MCU_USB (U400.21)
HE1_A: MCU_USB (U400.14), Headers (J504.5)
HE1_B: MCU_USB (U400.12), Headers (J504.6)
HE2_A: MCU_USB (U400.11), Headers (J503.6)
HE2_B: MCU_USB (U400.10), Headers (J503.5)
IS1: Driver (C204.1 R206.1), MCU_USB (U400.18)
IS2: Driver (C205.1 R207.1), MCU_USB (U400.19)
M1_N: Driver (U200.7 U200.8), Headers (J504.4)
M1_P: Driver (U200.1 U200.14), Headers (J504.3)
M2_N: Driver (U201.7 U201.8), Headers (J503.4)
M2_P: Driver (U201.1 U201.14), Headers (J503.3)
PA15: MCU_USB (U400.38), Headers (P505.1)
PB3: MCU_USB (U400.39), Headers (P505.2)
PB4: MCU_USB (U400.40), Headers (P505.3)
PB5: MCU_USB (U400.41), Headers (P505.4)
PB8: MCU_USB (U400.45), Headers (P505.5)
RF_DATA: MCU_USB (U400.13), Headers (R500.1)
SCK: Driver (R204.1 R205.1), MCU_USB (U400.15)
SCL: MCU_USB (R410.1 U400.42), Headers (J500.3 J501.3 J502.3 P500.3)
SDA: MCU_USB (R409.1 U400.43), Headers (J500.4 J501.4 J502.4 P500.4)
SDI: Driver (R201.1), MCU_USB (U400.17)
SDO: Driver (U201.9), MCU_USB (U400.16)
SERVO: MCU_USB (U400.46), Headers (R504.2)
SWCLK: MCU_USB (U400.37), Headers (P504.4 R503.2)
SWDIO: MCU_USB (U400.34), Headers (P504.3 R502.2)
TOF_1: MCU_USB (U400.2), Headers (J500.6)
TOF_2: MCU_USB (U400.3), Headers (J501.6)
TOF_3: MCU_USB (U400.4), Headers (J502.6)